# EasyEDA schematic tftclock.json
TITLE: TFTLCD Clock; REV: 1.0; Date: 2019-11-15; Sheet: 1/1; Drawn By: Radu C; Company: Your Company
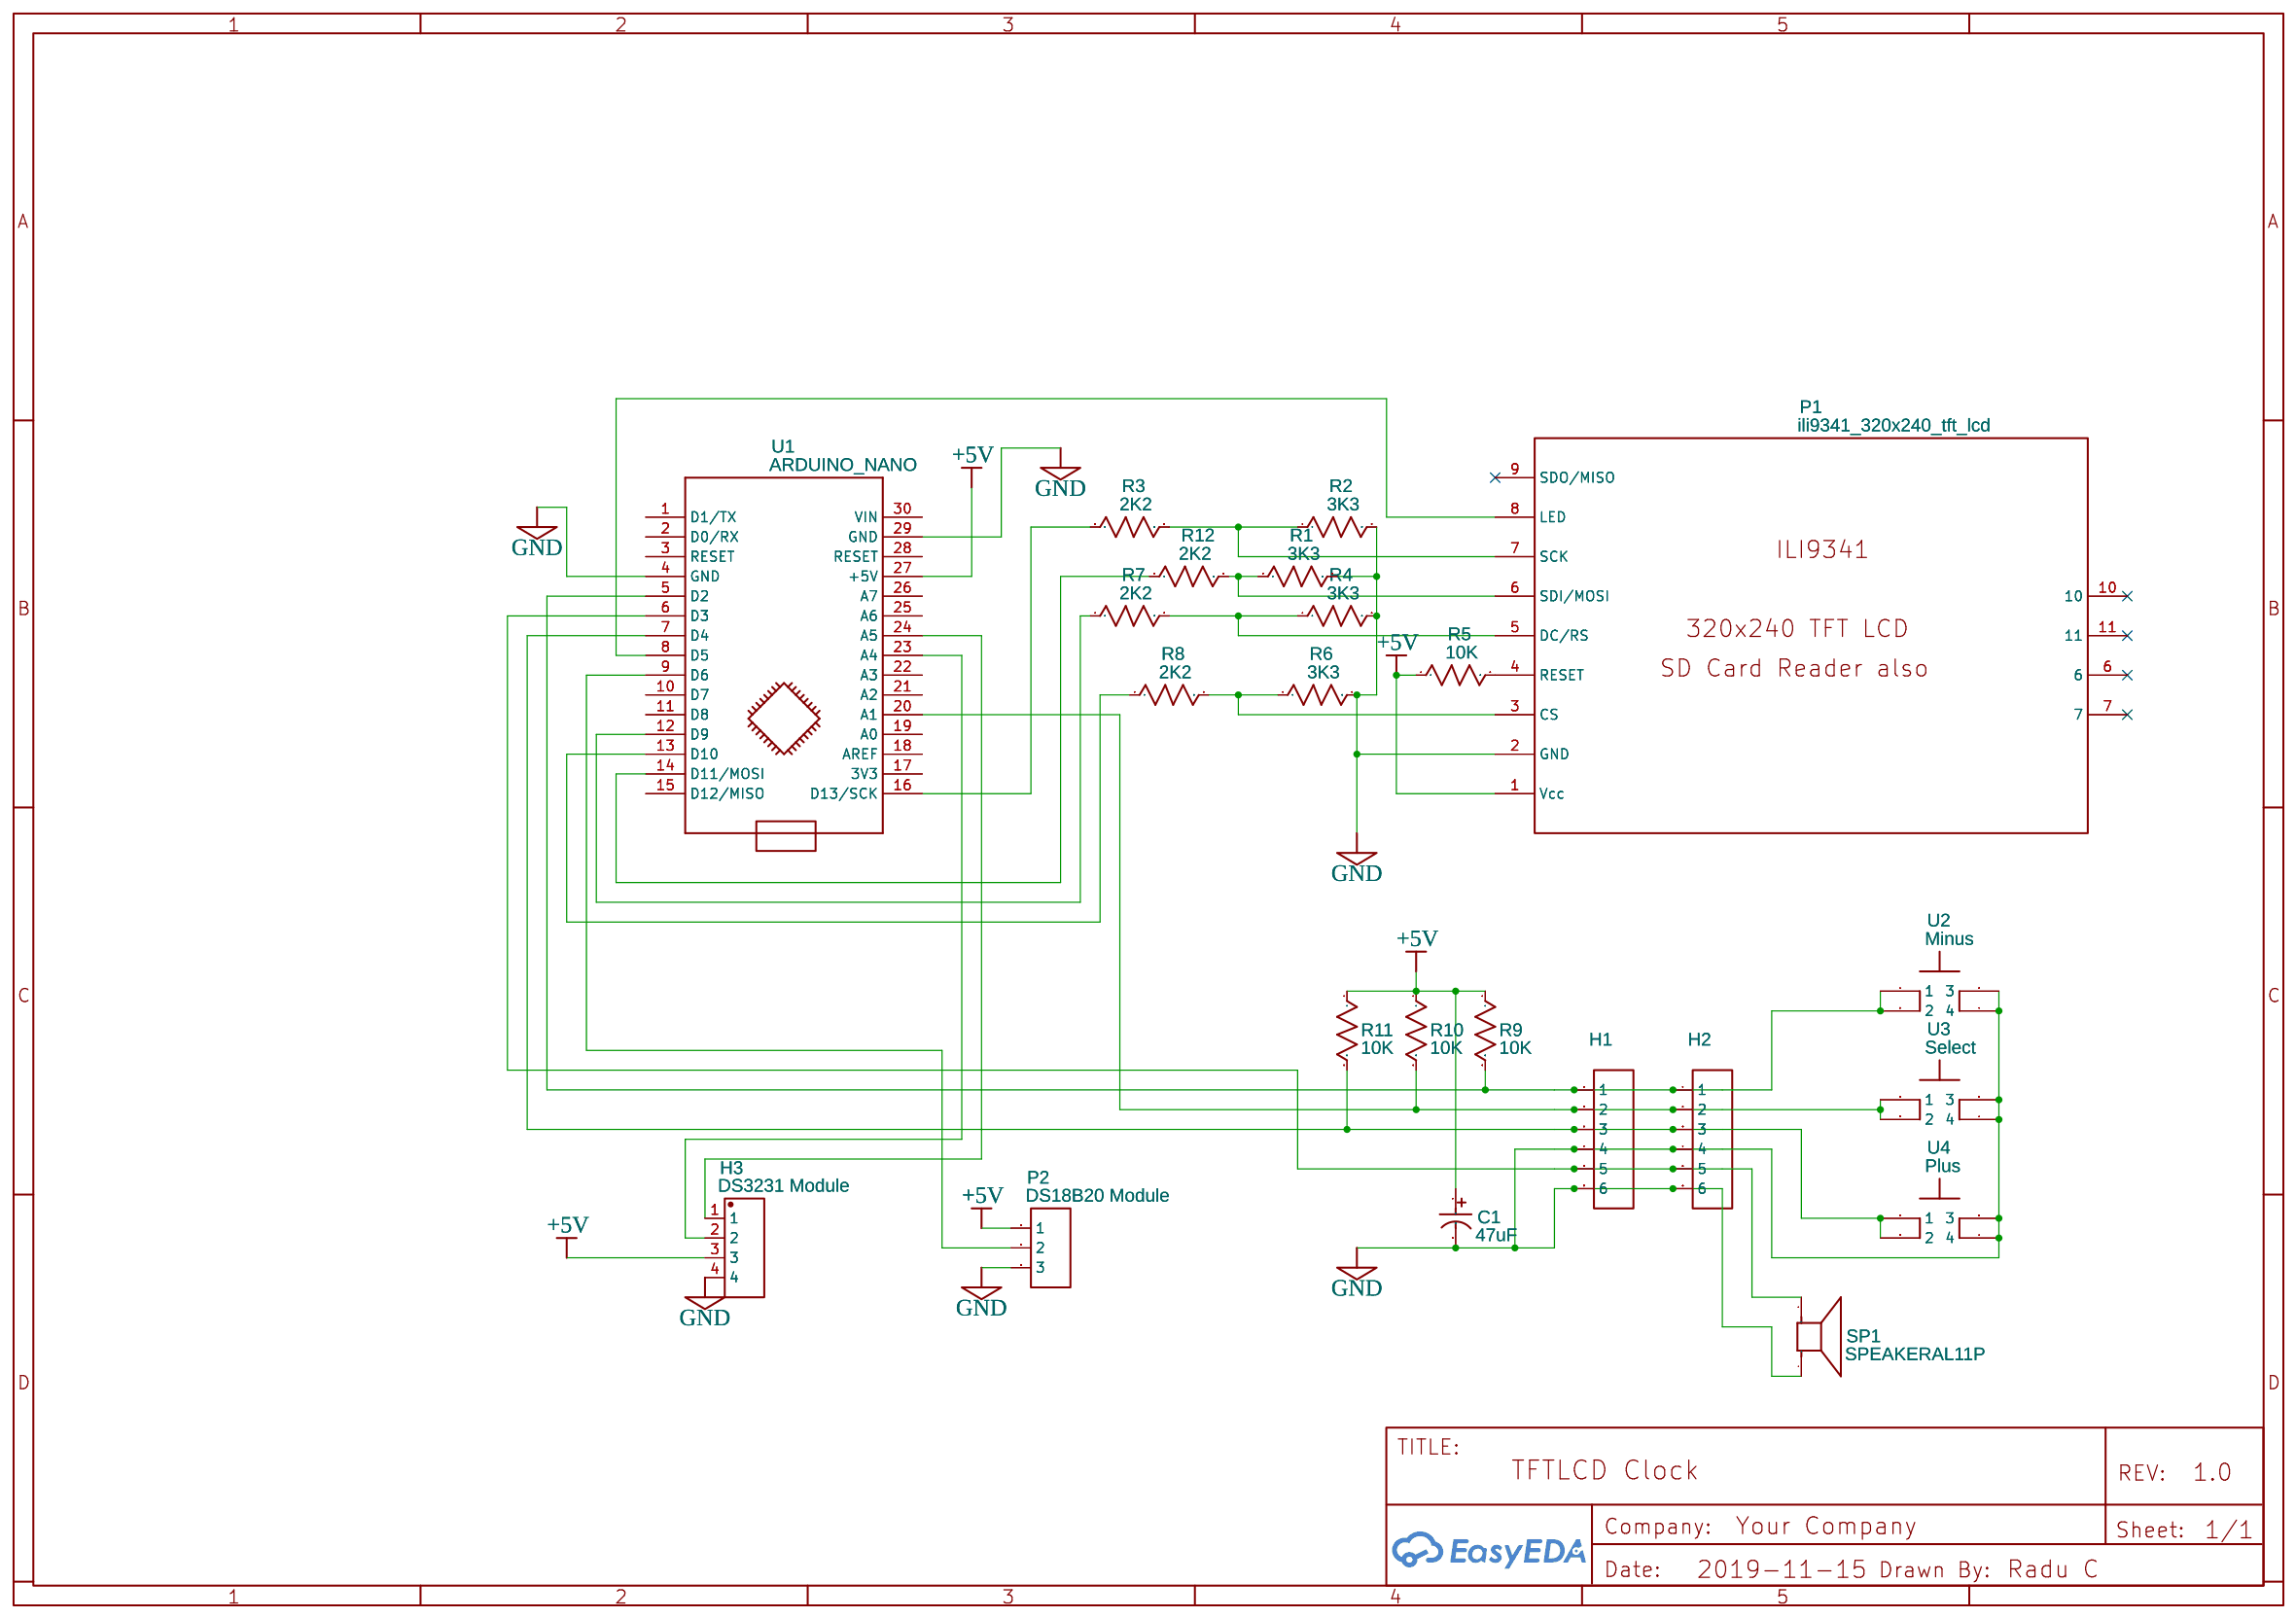
[diagram p0: schematic sheet]

## Parts
C1  47uF  [CAP-TH_BD5.0-P2.00-D0.8-FD]
H1  H  [HDR-TH_6P-P2.54-V]
H2  Header-Male-2.54_1x6  [HDR-TH_6P-P2.54-V]
H3  DS3231 Module  [HDR-TH_4P-P2.54-V]
P1  ili9341_320x240_tft_lcd  [ILI9341 320X240 TFT LCD]
P2  DS18B20 Module  [HDR-3X1/2.54]
R1  3K3  [1206]
R2  3K3  [1206]
R3  2K2  [1206]
R4  3K3  [1206]
R5  10K  [1206]
R6  3K3  [1206]
R7  2K2  [1206]
R8  2K2  [1206]
R9  10K  [1206]
R10  10K  [1206]
R11  10K  [1206]
R12  2K2  [1206]
SP1  SPEAKERAL11P  [AL11P]
U1  ARDUINO_NANO  [ARDUINO_NANO]
U2  Minus  [PUSH BUTTON 4 PIN DIP]
U3  Select  [PUSH BUTTON 4 PIN DIP]
U4  Plus  [PUSH BUTTON 4 PIN DIP]

## Library data of the parts
C1 = 47uF 16V Aluminum electrolytic capacitors: Supplier: LCSC; Manufacturer: ValuePro; Supplier Part: C22320
H1 = -: Supplier: LCSC; Manufacturer: BOOMELE; Manufacturer Part: Header-Male-2.54_1x6; Supplier Part: C37208
H2 = -: Supplier: LCSC; Manufacturer: BOOMELE; Supplier Part: C37208
H3 = -: Supplier: LCSC; Manufacturer: ReliaPro; Manufacturer Part: Headers  Pins 1*4P; image: http://image.lceda.cn/szlcsc/C59481.jpg; Supplier Part: C59481
P1 = -: sourceId: VFcm82uym; CONTROLLER: ILI9341; Contributor: mtqt
P2 = -: Supplier Part: C146243; Supplier: LCSC; Manufacturer: Boom Precision Elec; Manufacturer Part: Header-Female-2.54_1x3; link: https://datasheet.lcsc.com/szlcsc/Boom-Precision-Elec-2-54mm-1-8P-Straight-Female-header_C27438.pdf
R1-R12 = 1206
SP1 = -: SPEAKER Source: BuerklinAdded PS12 (for part # PS1240 piezo) http:www.ladyada.netlibrarypcbeaglelibrary.html; Contributor: Adafruit
U1 = -: sourceId: KGSeAWhDB
U2-U4 = -: Manufacturer Part: Pushbutton; Contributor: elnino; Supplier: LAMINGTON

## Nets
+5V: C1.1 H3.3 P1.1(Vcc) P2.1 R5.1 R9.1 R10.1 R11.1 U1.27(+5V)
GND: C1.2 H1.4 H1.6 H2.4 H2.6 H3.4 P1.2(GND) P2.3 R1.2 R2.2 R4.2 R6.2 SP1.- U1.4(GND) U1.29(GND) U2.3 U2.4 U3.3 U3.4 U4.3 U4.4
Net-(H1-1): H1.1 H2.1 R9.2 U1.5(D2) U2.1 U2.2
Net-(H1-2): H1.2 H2.2 R10.2 U1.20(A1) U3.1 U3.2
Net-(H1-3): H1.3 H2.3 R11.2 U1.7(D4) U4.1 U4.2
Net-(H1-5): H1.5 H2.5 SP1.+ U1.6(D3)
Net-(H3-1): H3.1 U1.24(A5)
Net-(H3-2): H3.2 U1.23(A4)
Net-(P1-3): P1.3(CS) R6.1 R8.2
Net-(P1-4): P1.4(RESET) R5.2
Net-(P1-5): P1.5(DC/RS) R4.1 R7.2
Net-(P1-6): P1.6 R1.1 R12.2
Net-(P1-7): P1.7 R2.1 R3.2
Net-(P1-8): P1.8(LED) U1.8(D5)
Net-(P2-2): P2.2 U1.9(D6)
Net-(R3-1): R3.1 U1.16(D13/SCK)
Net-(R7-1): R7.1 U1.12(D9)
Net-(R8-1): R8.1 U1.13(D10)
Net-(R12-1): R12.1 U1.14(D11/MOSI)

Not connected (* = marked no-connect by the designer): P1 9(SDO/MISO)* 10* 11*; U1 1(D1/TX) 2(D0/RX) 3(RESET) 10(D7) 11(D8) 15(D12/MISO) 17(3V3) 18(AREF) 19(A0) 21(A2) 22(A3) 25(A6) 26(A7) 28(RESET) 30(VIN)
